# Altium project LDOTEST.PrjPCB
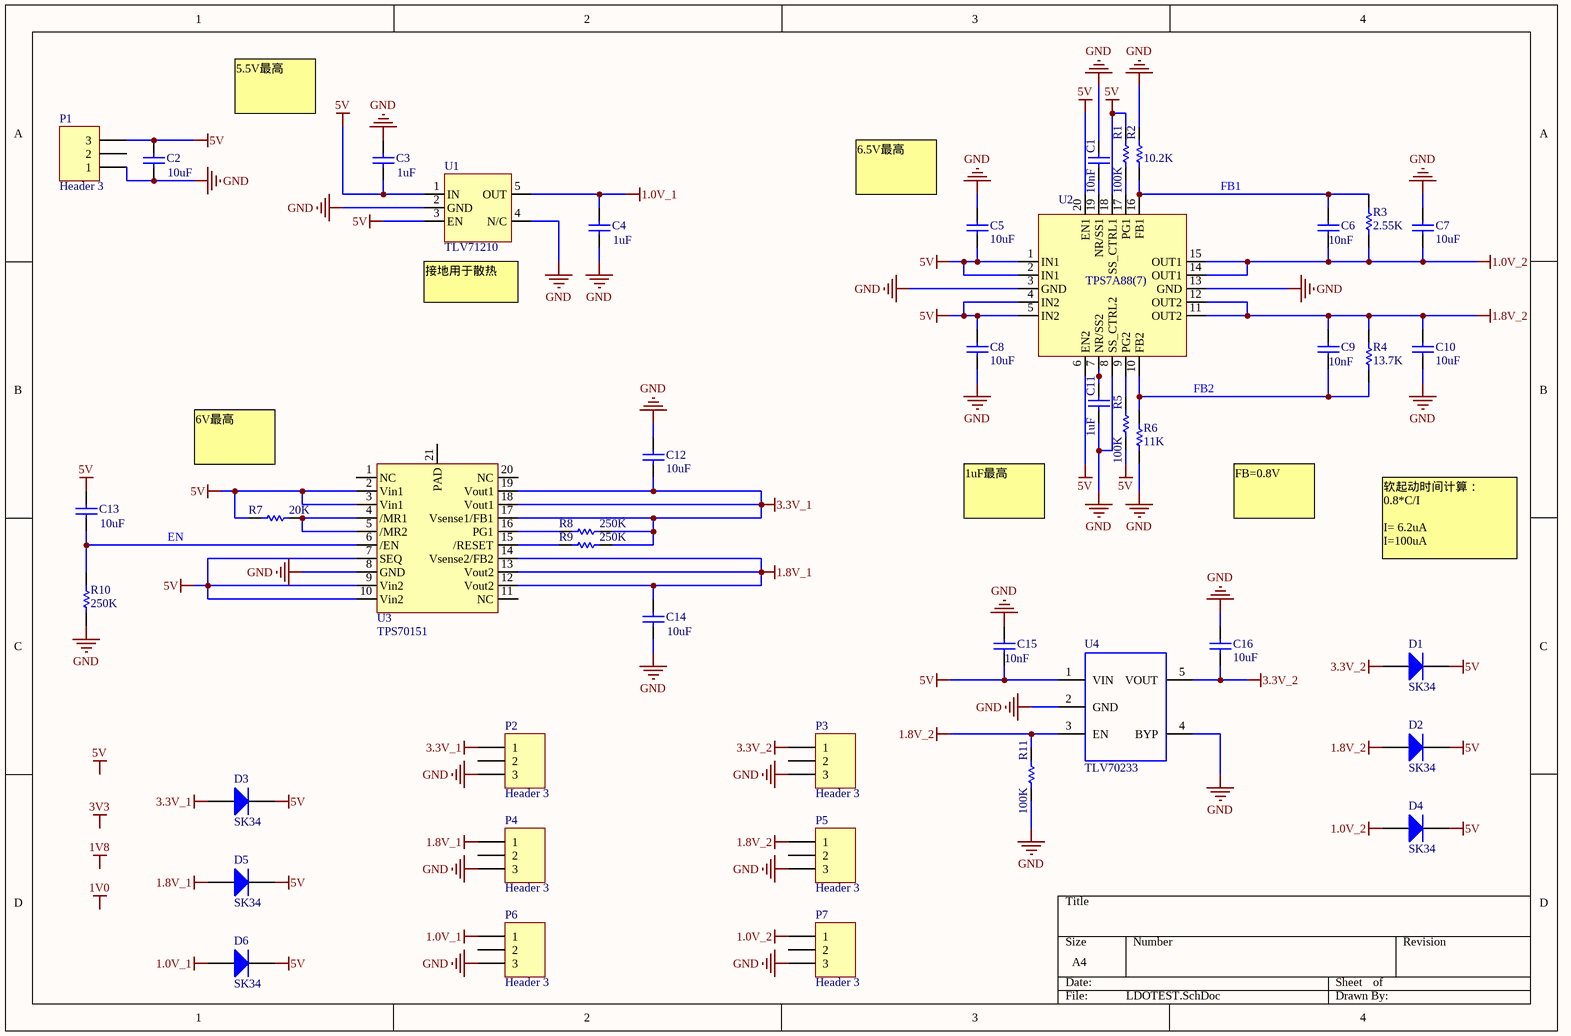
[diagram p0: LDOTEST.SchDoc]
1 sheet, 44 parts. Net scope: global (net labels, ports and power ports of the same name join across sheets).
Board file: LDOTEST.PcbDoc

## Sheet LDOTEST.SchDoc
size A4

### Parts
C1  value 10nF  [C2012]  (hidden comment: Cap)
C2  value 10uF  [C2012]  (hidden comment: Cap)
C3  value 1uF  [C2012]  (hidden comment: Cap)
C4  value 1uF  [C2012]  (hidden comment: Cap)
C5  value 10uF  [C2012]  (hidden comment: Cap)
C6  value 10nF  [C2012]  (hidden comment: Cap)
C7  value 10uF  [C2012]  (hidden comment: Cap)
C8  value 10uF  [C2012]  (hidden comment: Cap)
C9  value 10nF  [C2012]  (hidden comment: Cap)
C10  value 10uF  [C2012]  (hidden comment: Cap)
C11  value 1uF  [C2012]  (hidden comment: Cap)
C12  value 10uF  [C2012]  (hidden comment: Cap)
C13  value 10uF  [C2012]  (hidden comment: Cap)
C14  value 10uF  [C2012]  (hidden comment: Cap)
C15  value 10nF  [C2012]  (hidden comment: Cap)
C16  value 10uF  [C2012]  (hidden comment: Cap)
D1  SK34  [1206]
D2  SK34  [1206]
D3  SK34  [1206]
D4  SK34  [1206]
D5  SK34  [1206]
D6  SK34  [1206]
P1  Header 3  [HDR1X3]
P2  Header 3  [HDR1X3]
P3  Header 3  [HDR1X3]
P4  Header 3  [HDR1X3]
P5  Header 3  [HDR1X3]
P6  Header 3  [HDR1X3]
P7  Header 3  [HDR1X3]
R1  value 100K  [R2012]  (hidden comment: Res)
R2  value 10.2K  [R2012]  (hidden comment: Res)
R3  value 2.55K  [R2012]  (hidden comment: Res)
R4  value 13.7K  [R2012]  (hidden comment: Res)
R5  value 100K  [R2012]  (hidden comment: Res)
R6  value 11K  [R2012]  (hidden comment: Res)
R7  value 20K  [R2012]  (hidden comment: Res)
R8  value 250K  [R2012]  (hidden comment: Res)
R9  value 250K  [R2012]  (hidden comment: Res)
R10  value 250K  [R2012]  (hidden comment: Res)
R11  value 100K  [R2012]  (hidden comment: Res)
U1  TLV71210  [TLV712]
U2  TPS7A88(7)  [TPS7A88(7)]
U3  TPS70151  [TPS701]
U4  TLV70233  [SOT-23-5]

### Nets
1.0V_1: C4.1 D6.1(A) P6.1 U1.5(OUT)
1.0V_2: C6.2 C7.1 D4.1(A) P7.1 R3.2 U2.14(OUT1) U2.15(OUT1)
1.8V_1: C14.1 D5.1(A) P4.1 U3.12(Vout2) U3.13(Vout2) U3.14(Vsense2/FB2)
1.8V_2: C9.1 C10.1 D2.1(A) P5.1 R4.1 R11.1 U2.11(OUT2) U2.12(OUT2) U4.3(EN)
3.3V_1: C12.1 D3.1(A) P2.1 R8.1 R9.1 U3.17(Vsense1/FB1) U3.18(Vout1) U3.19(Vout1)
3.3V_2: C16.1 D1.1(A) P3.1 U4.5(VOUT)
5V: C2.1 C3.2 C5.1 C8.1 C13.1 C15.2 D1.2(K) D2.2(K) D3.2(K) D4.2(K) D5.2(K) D6.2(K) P1.3 R1.1 R5.2 R7.2 U1.1(IN) U1.3(EN) U2.1(IN1) U2.2(IN1) U2.4(IN2) U2.5(IN2) U2.6(EN2) U2.18(SS_CTRL1) U2.20(EN1) U3.2(Vin1) U3.3(Vin1) U3.7(SEQ) U3.9(Vin2) U3.10(Vin2) U4.1(VIN)
GND: C1.2 C2.2 C3.1 C4.2 C5.2 C7.2 C8.2 C10.2 C11.2 C12.2 C14.2 C15.1 C16.2 P1.1 P2.3 P3.3 P4.3 P5.3 P6.3 P7.3 R2.1 R6.2 R10.2 R11.2 U1.2(GND) U1.4(N/C) U2.3(GND) U2.8(SS_CTRL2) U2.13(GND) U3.8(GND) U4.2(GND) U4.4(BYP)
EN: C13.2 R10.1 U3.6(/EN)
FB1: C6.1 R2.2 R3.1 U2.16(FB1)
FB2: C9.2 R4.2 R6.1 U2.10(FB2)
NetC1_1: C1.1 U2.19(NR/SS1)
NetC11_1: C11.1 U2.7(NR/SS2)
NetR1_2: R1.2 U2.17(PG1)
NetR5_1: R5.1 U2.9(PG2)
NetR7_1: R7.1 U3.4(/MR1) U3.5(/MR2)
NetR8_2: R8.2 U3.16(PG1)
NetR9_2: R9.2 U3.15(/RESET)

Not connected (* = marked no-connect by the designer): P1 2; P2 2; P3 2; P4 2; P5 2; P6 2; P7 2; U3 1(NC) 11(NC) 20(NC) 21(PAD)

### Notes on the sheet
- 5.5V最高
- (near C5) 6.5V最高
- (near U1) 接地用于散热
- 6V最高
- 1uF最高
- FB=0.8V
- 软起动时间计算：
  0.8*C/I
  I= 6.2uA
  I=100uA
- Labels drawn without touching a wire or pin: 1V0, 1V8, 3V3, 5V

### Library data of the parts
C1-C16 = Cap: 贴片电容; Published: 8-Jun-2000; LatestRevisionDate: 17-Jul-2002; LatestRevisionNote: Re-released for DXP Platform.; PackageReference: RAD-0.3; Publisher: Altium Limited
D1-D6 = Diode 1N4148: High Conductance Fast Diode; LatestRevisionDate: 17-Jul-2002; LatestRevisionNote: Re-released for DXP Platform.; DatasheetDocument: 1997; PackageReference: DO-35; Publisher: Altium Limited; Code_JEDEC: DO-204-AH; ComponentLink1Description: Manufacturer Link; ComponentLink2Description: Datasheet; ComponentLink2URL: http://www.fairchildsemi.com/ds/1N%2F1N4148.pdf
P1-P7 = Header 3: Header, 3-Pin; LatestRevisionDate: 17-Jul-2002; LatestRevisionNote: Re-released for DXP Platform.; Publisher: Altium Limited
R1-R11 = Res: 贴片电阻; Published: 8-Jun-2000; LatestRevisionDate: 17-Jul-2002; LatestRevisionNote: Re-released for DXP Platform.; PackageReference: AXIAL-0.3; Publisher: Altium Limited
U1 = TLV712
U3 = TPS701
U4 = MIC5219: LDO